# Altium schematic sheet [1]WaxWatch.SchDoc: MaxWatch
size A4; Author: Maksym Omelchenko; DrawnBy: Maksym Omelchenko; Engineer: Maksym Omelchenko; Revision: v1.0; SheetNumber: 1; SheetTotal: 2
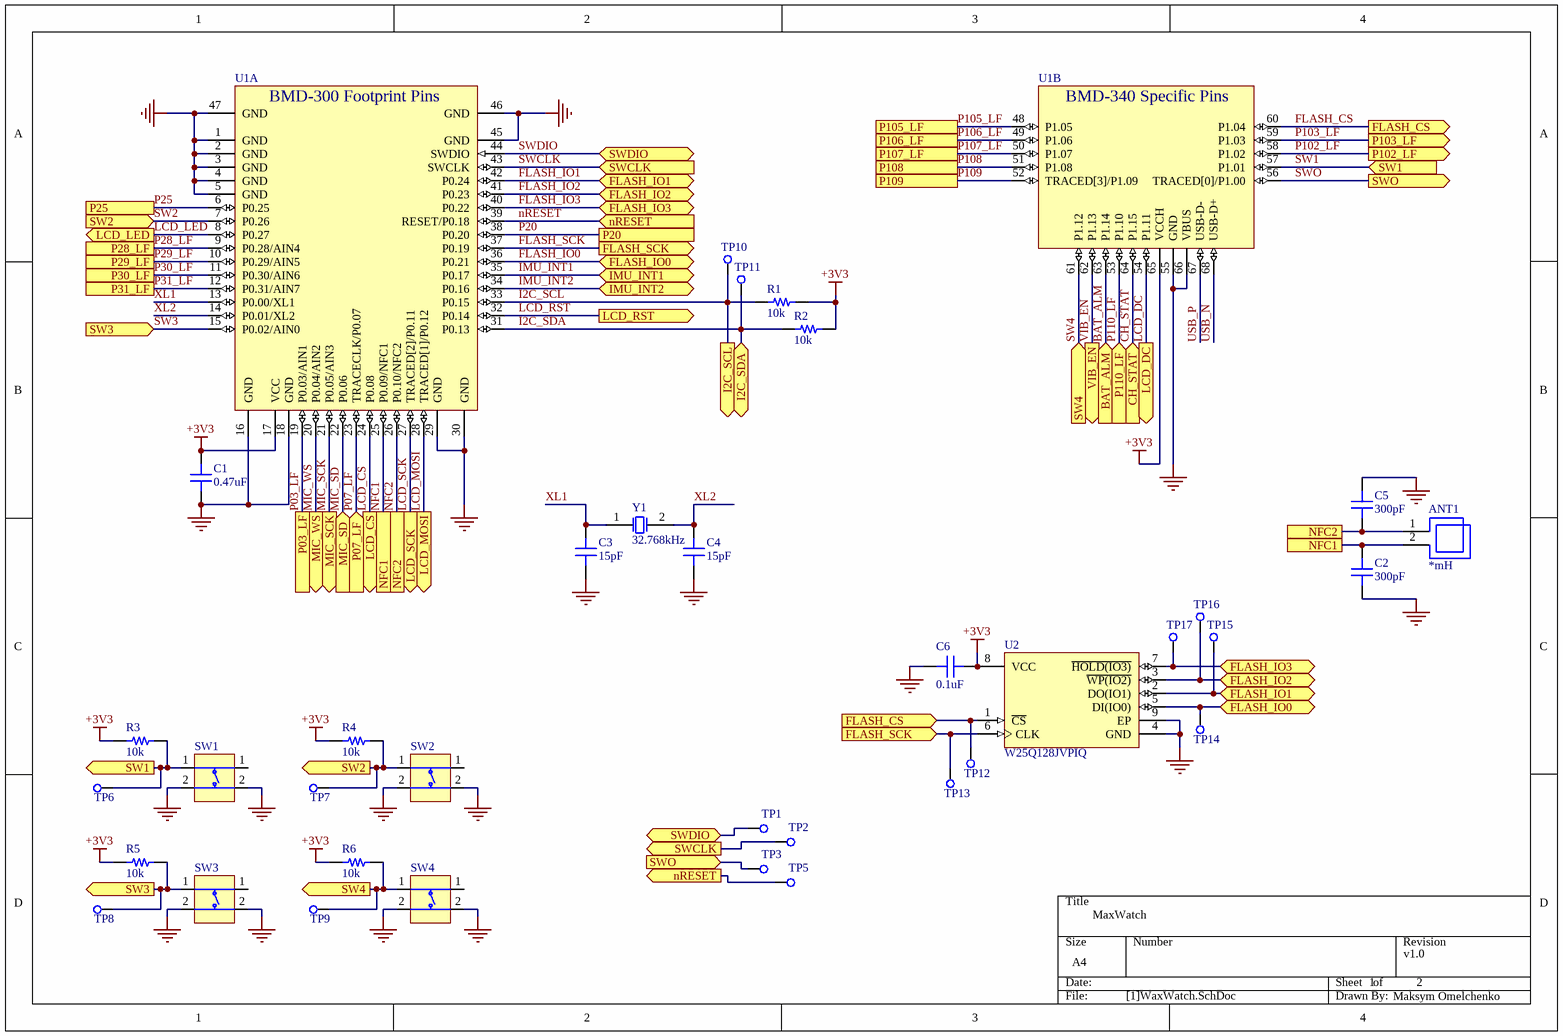
[diagram p0: [1]WaxWatch.SchDoc]

## Parts
ANT1  value *mH  [PCBComponent_1]  (hidden comment: NFC_Antenna)
C1  0.47uF  [CAP 0402/1005]
C2  300pF  [CAP 0402/1005]
C3  15pF  [CAP 0402/1005]
C4  15pF  [CAP 0402/1005]
C5  300pF  [CAP 0402/1005]
C6  0.1uF  [CAP 0402/1005]
R1  10k  [RES 0201/0603]
R2  10k  [RES 0201/0603]
R3  10k  [RES 0201/0603]
R4  10k  [RES 0201/0603]
R5  10k  [RES 0201/0603]
R6  10k  [RES 0201/0603]
SW1  EVQ-P7J01P  [SW_EVQP7J01P]  (value not drawn)
SW2  EVQ-P7J01P  [SW_EVQP7J01P]  (value not drawn)
SW3  EVQ-P7J01P  [SW_EVQP7J01P]  (value not drawn)
SW4  EVQ-P7J01P  [SW_EVQP7J01P]  (value not drawn)
TP1  TP  [TP_1.25x1.25]  (value not drawn)
TP2  TP  [TP_1.25x1.25]  (value not drawn)
TP3  TP  [TP_1.25x1.25]  (value not drawn)
TP5  TP  [TP_1.25x1.25]  (value not drawn)
TP6  TP  [TP_0.75x0.75]  (value not drawn)
TP7  TP  [TP_0.75x0.75]  (value not drawn)
TP8  TP  [TP_0.75x0.75]  (value not drawn)
TP9  TP  [TP_0.75x0.75]  (value not drawn)
TP10  TP  [TP_0.75x0.75]  (value not drawn)
TP11  TP  [TP_0.75x0.75]  (value not drawn)
TP12  TP  [TP_0.75x0.75]  (value not drawn)
TP13  TP  [TP_0.75x0.75]  (value not drawn)
TP14  TP  [TP_0.75x0.75]  (value not drawn)
TP15  TP  [TP_0.75x0.75]  (value not drawn)
TP16  TP  [TP_0.75x0.75]  (value not drawn)
TP17  TP  [TP_0.75x0.75]  (value not drawn)
U1  Manufacturer P/N: BMD-340-A-ES  [BMD-340]  (hidden comment: BMD-340-A)  (parts A,B of 2)
U2  W25Q128JVPIQ  [W25Q128JVPIG]
Y1  32.768kHz  [KX-327NHT]

## Ports
BAT_ALM (in), CH_STAT (in), FLASH_CS (in), FLASH_CS (out), FLASH_IO0 (bidir), FLASH_IO1 (bidir), FLASH_IO2 (bidir), FLASH_IO3 (bidir), FLASH_SCK (in), FLASH_SCK (out), I2C_SCL (out), I2C_SDA (bidir), IMU_INT1 (bidir), IMU_INT2 (bidir), LCD_CS (out), LCD_DC (out), LCD_LED (out), LCD_MOSI (out), LCD_RST (out), LCD_SCK (out), MIC_SCK (out), MIC_SD (in), MIC_WS (out), NFC1, NFC2, nRESET (in), nRESET (out), P03_LF, P07_LF (in), P20, P25, P28_LF, P29_LF, P30_LF, P31_LF, P102_LF (out), P103_LF (out), P105_LF, P106_LF, P107_LF, P108, P109, P110_LF (in), SW1 (in), SW1 (out), SW2 (in), SW2 (out), SW3 (in), SW3 (out), SW4 (in), SW4 (out), SWCLK (in), SWCLK (out), SWDIO (bidir), SWO (in), SWO (out), VIB_EN (out)

## Nets
+3V3: C1.2 C6.2 R1.1 R2.1 R3.2 R4.2 R5.2 R6.2 U1.17(VCC) U1.65(VCCH) U2.8(VCC)
GND: C1.1 C2.1 C3.1 C4.1 C5.2 C6.1 SW1.2 SW2.2 SW3.2 SW4.2 U1.1(GND) U1.2(GND) U1.3(GND) U1.4(GND) U1.5(GND) U1.16(GND) U1.18(GND) U1.29(GND) U1.30(GND) U1.45(GND) U1.46(GND) U1.47(GND) U1.55(GND) U1.66(VBUS) U2.4(GND) U2.9(EP)
BAT_ALM: U1.63(P1.14) ; port BAT_ALM
CH_STAT: U1.64(P1.15) ; port CH_STAT
FLASH_CS: TP12.1(TP) U1.60(P1.04) U2.1(~{CS}) ; port FLASH_CS
FLASH_IO0: TP14.1(TP) U1.36(P0.21) U2.5(DI(IO0)) ; port FLASH_IO0
FLASH_IO1: TP15.1(TP) U1.42(P0.24) U2.2(DO(IO1)) ; port FLASH_IO1
FLASH_IO2: TP16.1(TP) U1.41(P0.23) U2.3(~{WP(IO2)}) ; port FLASH_IO2
FLASH_IO3: TP17.1(TP) U1.40(P0.22) U2.7(~{HOLD(IO3)}) ; port FLASH_IO3
FLASH_SCK: TP13.1(TP) U1.37(P0.19) U2.6(CLK) ; port FLASH_SCK
I2C_SCL: R1.2 TP10.1(TP) U1.33(P0.15) ; port I2C_SCL
I2C_SDA: R2.2 TP11.1(TP) U1.31(P0.13) ; port I2C_SDA
IMU_INT1: U1.35(P0.17) ; port IMU_INT1
IMU_INT2: U1.34(P0.16) ; port IMU_INT2
LCD_CS: U1.24(P0.08) ; port LCD_CS
LCD_DC: U1.54(P1.11) ; port LCD_DC
LCD_LED: U1.8(P0.27) ; port LCD_LED
LCD_MOSI: U1.28(TRACED[1]/P0.12) ; port LCD_MOSI
LCD_RST: U1.32(P0.14) ; port LCD_RST
LCD_SCK: U1.27(TRACED[2]/P0.11) ; port LCD_SCK
MIC_SCK: U1.21(P0.05/AIN3) ; port MIC_SCK
MIC_SD: U1.22(P0.06) ; port MIC_SD
MIC_WS: U1.20(P0.04/AIN2) ; port MIC_WS
NFC1: ANT1.2 C2.2 U1.25(P0.09/NFC1) ; port NFC1
NFC2: ANT1.1 C5.1 U1.26(P0.10/NFC2) ; port NFC2
nRESET: TP5.1(TP) U1.39(RESET/P0.18) ; port nRESET
P03_LF: U1.19(P0.03/AIN1) ; port P03_LF
P07_LF: U1.23(TRACECLK/P0.07) ; port P07_LF
P20: U1.38(P0.20) ; port P20
P25: U1.6(P0.25) ; port P25
P28_LF: U1.9(P0.28/AIN4) ; port P28_LF
P29_LF: U1.10(P0.29/AIN5) ; port P29_LF
P30_LF: U1.11(P0.30/AIN6) ; port P30_LF
P31_LF: U1.12(P0.31/AIN7) ; port P31_LF
P102_LF: U1.58(P1.02) ; port P102_LF
P103_LF: U1.59(P1.03) ; port P103_LF
P105_LF: U1.48(P1.05) ; port P105_LF
P106_LF: U1.49(P1.06) ; port P106_LF
P107_LF: U1.50(P1.07) ; port P107_LF
P108: U1.51(P1.08) ; port P108
P109: U1.52(TRACED[3]/P1.09) ; port P109
P110_LF: U1.53(P1.10) ; port P110_LF
SW1: R3.1 SW1.1 TP6.1(TP) U1.57(P1.01) ; port SW1
SW2: R4.1 SW2.1 TP7.1(TP) U1.7(P0.26) ; port SW2
SW3: R5.1 SW3.1 TP8.1(TP) U1.15(P0.02/AIN0) ; port SW3
SW4: R6.1 SW4.1 TP9.1(TP) U1.61(P1.12) ; port SW4
SWCLK: TP2.1(TP) U1.43(SWCLK) ; port SWCLK
SWDIO: TP1.1(TP) U1.44(SWDIO) ; port SWDIO
SWO: TP3.1(TP) U1.56(TRACED[0]/P1.00) ; port SWO
USB_N: U1.68(USB-D+)
USB_P: U1.67(USB-D-)
VIB_EN: U1.62(P1.13) ; port VIB_EN
XL1: C3.2 U1.13(P0.00/XL1) Y1.1(X1)
XL2: C4.2 U1.14(P0.01/XL2) Y1.2(X2)

## Notes on the sheet
- Title
- Size:
- Date:
- A4
- Number:
- Time:
- Revision:
- Sheet
- of
- File:
- (in symbol BMD-340-A, part A) BMD-300 Footprint Pins
- (in symbol BMD-340-A, part B) BMD-340 Specific Pins

## Library data of the parts
C1 = CGB2A1X6S1A474K033BC: CAP CER 0.47UF 10V X6S 0402; Manufacturer: TDK Corporation; TemperatureRange: -55C ~ 105C; Tolerance: 10%; Value: 0.47uF; Part Number: CGB2A1X6S1A474K033BC; PartId: 12734; Supplier 1: Digi-Key; Supplier Part Number 1: 445-13193-2-ND; ComponentLink1Description: Datasheet; ComponentLink1URL: https://product.tdk.com/info/en/catalog/datasheets/mlcc_commercial_lowprofile_en.pdf; ComponentLink2Description: Digi-Key Listing; ComponentLink2URL: https://www.digikey.com/product-detail/en/tdk-corporation/CGB2A1X6S1A474K033BC/445-13193-2-ND/3950429; TemperatureCoefficient: X6S; Voltage: 10V; Price: 0,029; Device Package: 0402 (1005 Metric)
C2 C5 = GRM1555C1H301GA01D: CAP CER 300PF 50V NP0 0402; Manufacturer: Murata Electronics North America; TemperatureRange: -55C ~ 125C; TemperatureCoefficient: C0G, NP0; Tolerance: 2%; Value: 300pF; Part Number: GRM1555C1H301GA01D; PartId: 5216; Supplier 1: Digi-Key; Supplier Part Number 1: 490-6230-2-ND; ComponentLink1Description: Datasheet; ComponentLink1URL: http://www.murata.com/~/media/webrenewal/support/library/catalog/products/capacitor/mlcc/c02e.ashx; ComponentLink2Description: Digi-Key listing; ComponentLink2URL: http://digikey.com/product-detail/en/GRM1555C1H301GA01D/490-6230-2-ND/2543994; Voltage: 50V; Price: 0,0318; Type: -; Device Package: 0402 (1005 Metric)
C3 C4 = C1005C0G1H150F050BA: CAP CER 15PF 50V C0G 0402; Manufacturer: TDK Corporation; TemperatureRange: -55C ~ 125C; TemperatureCoefficient: C0G, NP0; Tolerance: 1%; Value: 15pF; Part Number: C1005C0G1H150F050BA; PartId: 3865; Supplier 1: Digi-Key; Supplier Part Number 1: 445-7007-2-ND; ComponentLink1Description: Datasheet; ComponentLink1URL: https://product.tdk.com/info/en/catalog/datasheets/mlcc_commercial_general_en.pdf; ComponentLink2Description: Digi-Key listing; ComponentLink2URL: http://digikey.com/product-detail/en/C1005C0G1H150F050BA/445-7007-2-ND/2674809; Voltage: 50V; Price: 0,1262; Type: -; Device Package: 0402 (1005 Metric)
C6 = C1005X7R1C104K050BC: CAP CER 0.1UF 16V X7R 0402; Manufacturer: TDK Corporation; TemperatureRange: -55C ~ 125C; Tolerance: 10%; Value: 0.1uF; Part Number: C1005X7R1C104K050BC; PartId: 3856; Supplier 1: Digi-Key; Supplier Part Number 1: 445-4952-2-ND; ComponentLink1Description: Datasheet; ComponentLink1URL: https://product.tdk.com/info/en/catalog/datasheets/mlcc_commercial_general_en.pdf; ComponentLink2Description: Digi-Key listing; ComponentLink2URL: http://digikey.com/product-detail/en/C1005X7R1C104K050BC/445-4952-2-ND/2093220; TemperatureCoefficient: X7R; Voltage: 16V; Price: 0,0066; Type: -; Device Package: 0402 (1005 Metric)
R1-R6 = RC0201JR-0710KL: RES SMD 10K OHM 5% 1/20W 0201; Manufacturer: Yageo; TemperatureRange: -55C ~ 125C; TemperatureCoefficient: 200ppm/C; PowerRating: 0.05W, 1/20W; Value: 10k; Part Number: RC0201JR-0710KL; PartId: 19453; Supplier 1: Digi-Key; Supplier Part Number 1: 311-10KNTR-ND; ComponentLink1Description: Datasheet; ComponentLink1URL: http://www.yageo.com/documents/recent/PYu-RC_Group_51_RoHS_L_04.pdf; ComponentLink2Description: Digi-Key Listing; ComponentLink2URL: https://www.digikey.com/product-detail/en/yageo/RC0201JR-0710KL/311-10KNTR-ND/1948901; Tolerance: 5%; Price: 0,0042; Device Package: 0201 (0603 Metric)
SW1-SW4 = EVQ-P7J01P: Switch Tactile N.O. SPST Rectangular Button Gull Wing 0.05A 12VDC 100000Cycle 1.6N SMD Embossed T/R; MF: Panasonic Electronic; Package: None; SnapEDA_Link: https://www.snapeda.com/parts/EVQ-P7J01P/Panasonic%20Electronic%20Components/view-part/?ref=snap; HelpURL: *; Parameter 1: *; Model: EVQ-P7J01P
U1 = BMD-340-A: Bluetooth 5 LE Module, PRELIMINARY, nRF52840, 1MB Flash, 256kB RAM; Manufacturer: Rigado, Inc; Internal Antenna: Yes; Protocol: BT 5 LE, 802.154/Thread, 2.4GHz Proprietary; Height: 1.9mm; Size: 15mm x 10.2mm; Part Number: BMD-340-A
U2 = W25Q128JVPIQ: Manufacturer: Winbond; HelpURL: https://www.digikey.com/product-detail/en/winbond-electronics/W25Q128JVPIQ/W25Q128JVPIQ-ND/6819668; Package: WSON-8; Model: W25Q128JVPIQ
Y1 = KX-327NHT: Manufacturer: GEYER; PartNumber: KX-327NHT; Frequency: 32.768 kHz; HelpURL: http://www.kosmodrom.com.ua/pdf/KX-327NHT.pdf